# Altium schematic sheet sedraPasaAltos.SchDoc
size A4
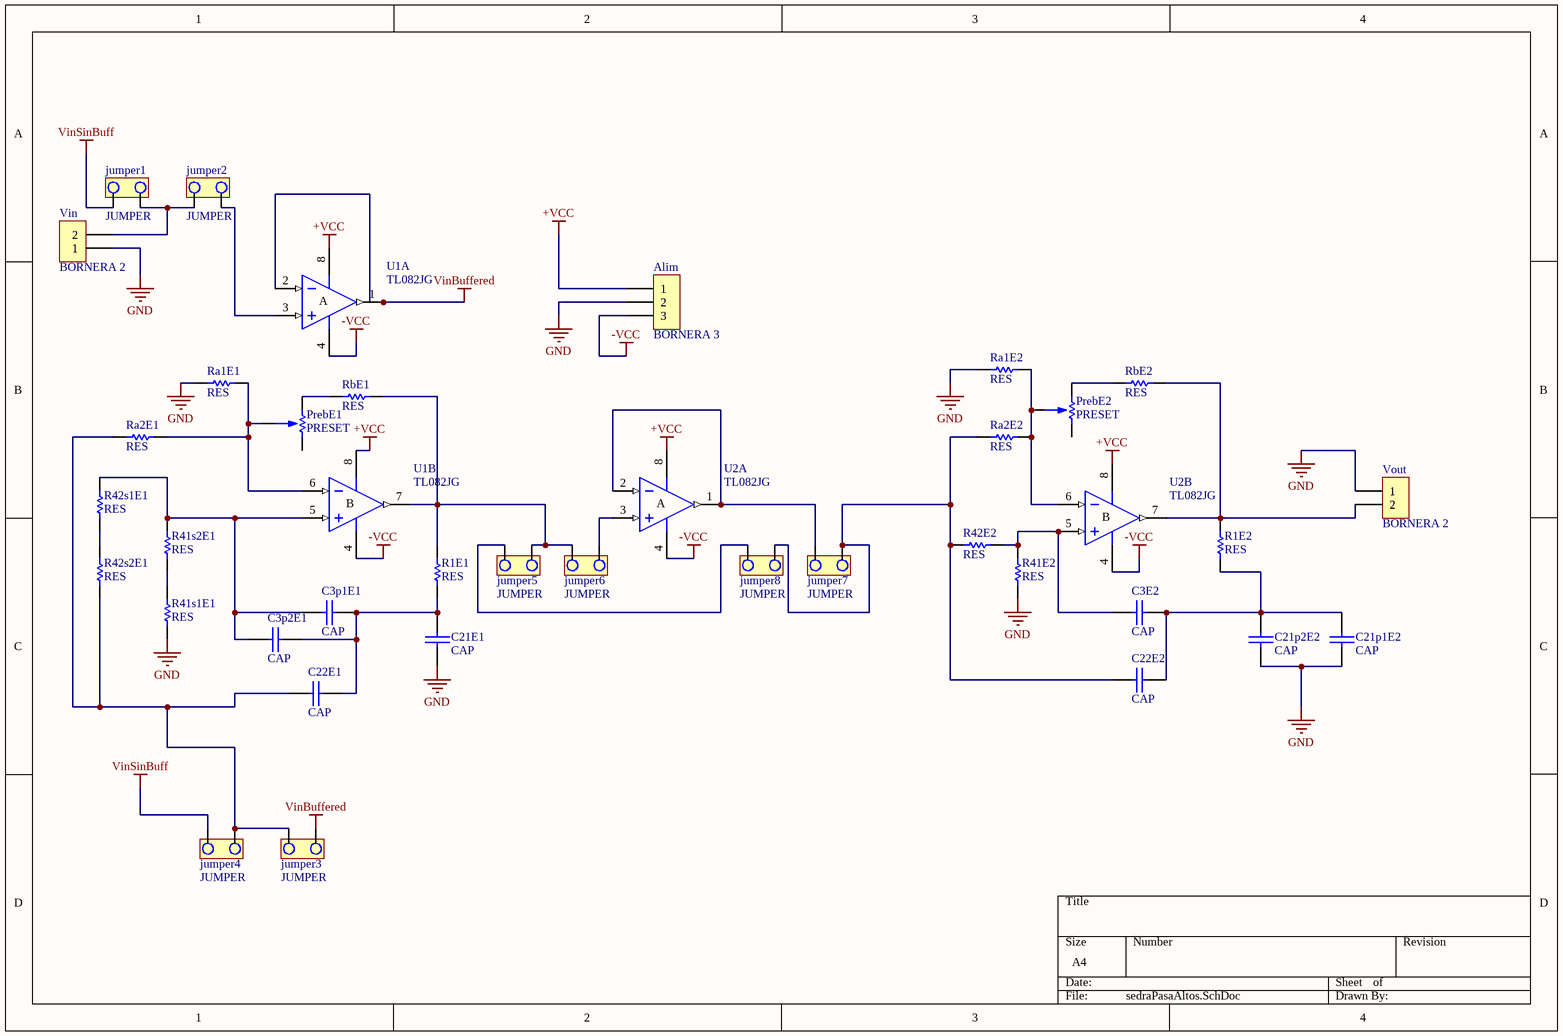
[diagram p0: sedraPasaAltos.SchDoc]

## Parts
Alim  BORNERA 3  [BORNERA3]
C3E2  CAP  [CAP200]
C3p1E1  CAP  [CAP200]
C3p2E1  CAP  [CAP200]
C21E1  CAP  [CAP200]
C21p1E2  CAP  [CAP200]
C21p2E2  CAP  [CAP200]
C22E1  CAP  [CAP200]
C22E2  CAP  [CAP200]
jumper1  JUMPER  [JUMPER2]
jumper2  JUMPER  [JUMPER2]
jumper3  JUMPER  [JUMPER2]
jumper4  JUMPER  [JUMPER2]
jumper5  JUMPER  [JUMPER2]
jumper6  JUMPER  [JUMPER2]
jumper7  JUMPER  [JUMPER2]
jumper8  JUMPER  [JUMPER2]
PrebE1  PRESET  [PRESET V]
PrebE2  PRESET  [PRESET V]
R1E1  RES  [RES400]
R1E2  RES  [0805]
R41E2  RES  [0805]
R41s1E1  RES  [0805]
R41s2E1  RES  [0805]
R42E2  RES  [0805]
R42s1E1  RES  [0805]
R42s2E1  RES  [0805]
Ra1E1  RES  [0805]
Ra1E2  RES  [0805]
Ra2E1  RES  [0805]
Ra2E2  RES  [0805]
RbE1  RES  [0805]
RbE2  RES  [0805]
U1  TL082JG  [JG008]  (parts A,B of 2)
U2  TL082JG  [JG008]  (parts A,B of 2)
Vin  BORNERA 2  [BORNERA2]
Vout  BORNERA 2  [BORNERA2]

## Nets
+VCC: Alim.1 U1.8(V+) U2.8(V+)
-VCC: Alim.3 U1.4(V-) U2.4(V-)
GND: Alim.2 C21E1.2 C21p1E2.2 C21p2E2.2 R41E2.1 R41s1E1.1 Ra1E1.1 Ra1E2.1 Vin.1 Vout.1
VinBuffered: jumper3.2 U1.1(OUT) U1.2(IN-)
VinSinBuff: jumper1.2 jumper4.1
NetC3E2_1: C3E2.1 R41E2.2 R42E2.2 U2.5(IN+)
NetC3E2_2: C3E2.2 C21p1E2.1 C21p2E2.1 C22E2.2 R1E2.1
NetC3p1E1_1: C3p1E1.1 C3p2E1.1 R41s2E1.2 R42s1E1.2 U1.5(IN+)
NetC3p1E1_2: C3p1E1.2 C3p2E1.2 C21E1.1 C22E1.2 R1E1.1
NetC22E1_1: C22E1.1 jumper3.1 jumper4.2 R42s2E1.1 Ra2E1.1
NetC22E2_1: C22E2.1 jumper7.2 jumper8.2 R42E2.1 Ra2E2.1
Netjumper1_1: jumper1.1 jumper2.2 Vin.2
Netjumper2_1: jumper2.1 U1.3(IN+)
Netjumper5_1: jumper5.1 jumper8.1
Netjumper5_2: jumper5.2 jumper6.1 R1E1.2 RbE1.2 U1.7(OUT)
Netjumper6_2: jumper6.2 U2.3(IN+)
Netjumper7_1: jumper7.1 U2.1(OUT) U2.2(IN-)
NetPrebE1_2: PrebE1.2 Ra1E1.2 Ra2E1.2 U1.6(IN-)
NetPrebE1_3: PrebE1.3 RbE1.1
NetPrebE2_2: PrebE2.2 Ra1E2.2 Ra2E2.2 U2.6(IN-)
NetPrebE2_3: PrebE2.3 RbE2.1
NetR1E2_2: R1E2.2 RbE2.2 U2.7(OUT) Vout.2
NetR41s1E1_2: R41s1E1.2 R41s2E1.1
NetR42s1E1_1: R42s1E1.1 R42s2E1.2

Not connected (* = marked no-connect by the designer): PrebE1 1; PrebE2 1

## Notes on the sheet
- (in symbol TL082JG, part A) A
- (in symbol TL082JG, part B) B

## Library data of the parts
U1 U2 = TL082JG: JFET-Input Operational Amplifier; Published: 16-Jan-2001; LatestRevisionDate: 04-Mar-2005; LatestRevisionNote: Stylized 3D Model Added.; DatasheetVersion: Feb-1999; PackageVersion: Jan-1995; PackageReference: JG008; Publisher: Altium Limited; PackageDescription: DIP; 8 Leads; Row Spacing 7.62 mm; Pitch 2.54 mm; ComponentLink1Description: Manufacturer Link; ComponentLink1URL: http://www.ti.com/; ComponentLink2Description: Datasheet; ComponentLink2URL: http://www-s.ti.com/sc/ds/tl082.pdf